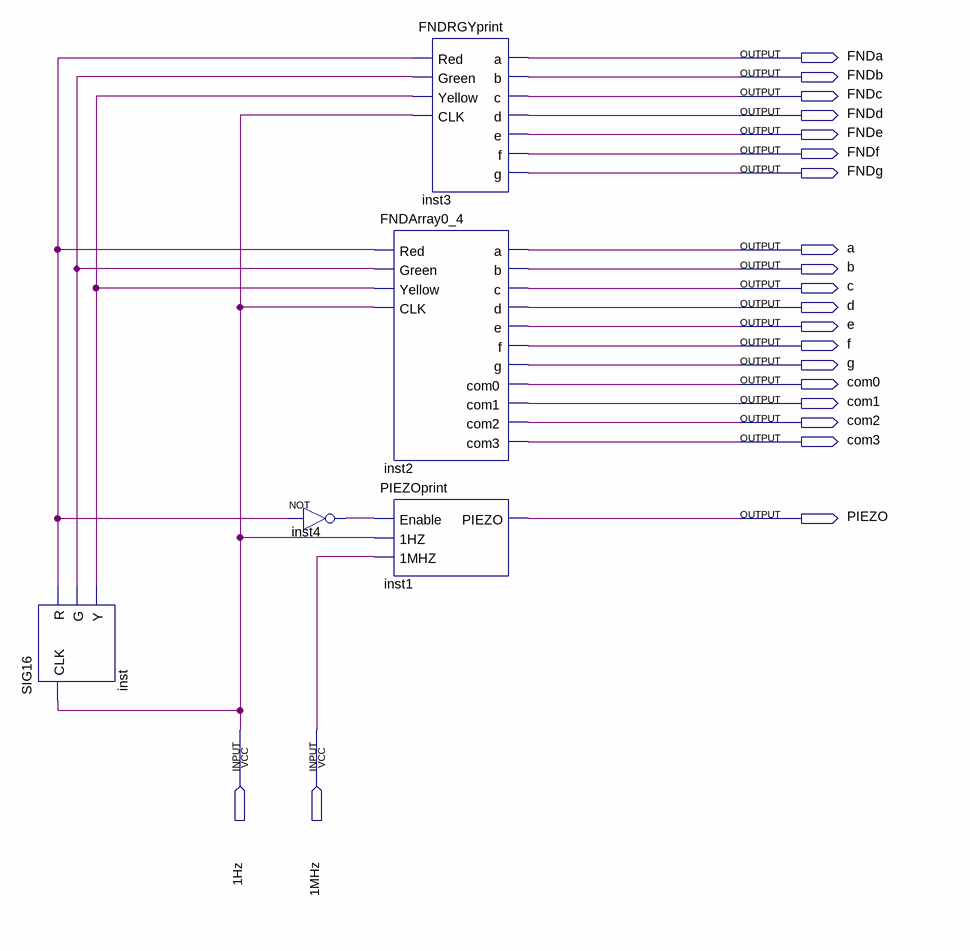
[diagram p0: schematic sheet]
// Quartus schematic SinHoGi.bdf as structural Verilog: 5 symbols, 21 pins
module SinHoGi (
  input  \1Hz ,
  input  \1MHz ,
  output FNDa,
  output FNDb,
  output FNDc,
  output FNDd,
  output FNDe,
  output FNDf,
  output FNDg,
  output a,
  output b,
  output c,
  output d,
  output e,
  output f,
  output g,
  output com0,
  output com1,
  output com2,
  output com3,
  output PIEZO
);

  wire inst4_out, inst_g, inst_r, inst_y;

  SIG16 inst (.CLK(\1Hz ), .R(inst_r), .G(inst_g), .Y(inst_y));
  not inst4 (inst4_out, inst_r);
  FNDArray0_4 inst2 (
    .Red(inst_r), .Green(inst_g), .Yellow(inst_y), .CLK(\1Hz ), .a(a), .b(b), .c(c), .d(d), .e(e), .f(f),
    .g(g), .com0(com0), .com1(com1), .com2(com2), .com3(com3));
  PIEZOprint inst1 (.Enable(inst4_out), .\1HZ (\1Hz ), .\1MHZ (\1MHz ), .PIEZO(PIEZO));
  FNDRGYprint inst3 (
    .Red(inst_r), .Green(inst_g), .Yellow(inst_y), .CLK(\1Hz ), .a(FNDa), .b(FNDb), .c(FNDc), .d(FNDd),
    .e(FNDe), .f(FNDf), .g(FNDg));
endmodule
